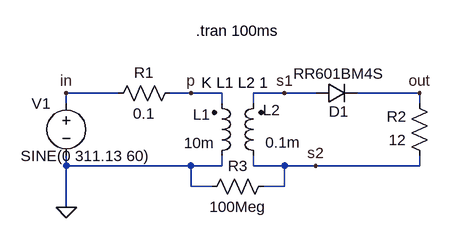
[diagram p0: schematic Exp01_ret.asc]
Exp01_ret.asc, the LTspice schematic file:
Version 4
SHEET 1 880 680
WIRE 352 112 272 112
WIRE 464 112 432 112
WIRE 512 112 464 112
WIRE 608 112 560 112
WIRE 656 112 608 112
WIRE 816 112 720 112
WIRE 272 128 272 112
WIRE 512 128 512 112
WIRE 560 128 560 112
WIRE 816 128 816 112
WIRE 272 224 272 208
WIRE 464 224 272 224
WIRE 512 224 512 208
WIRE 512 224 464 224
WIRE 560 224 560 208
WIRE 608 224 560 224
WIRE 656 224 608 224
WIRE 816 224 816 208
WIRE 816 224 656 224
WIRE 464 256 464 224
WIRE 496 256 464 256
WIRE 608 256 608 224
WIRE 608 256 576 256
WIRE 272 288 272 224
FLAG 272 288 0
FLAG 272 112 in
FLAG 464 112 p
FLAG 608 112 s1
FLAG 656 224 s2
FLAG 816 112 out
SYMBOL voltage 272 112 M0
WINDOW 3 -130 97 Left 2
WINDOW 123 0 0 Left 0
WINDOW 39 0 0 Left 0
SYMATTR InstName V1
SYMATTR Value SINE(0 311.13 60)
SYMBOL ind2 496 224 M180
WINDOW 0 -29 79 Left 2
WINDOW 3 -43 35 Left 2
SYMATTR InstName L1
SYMATTR Value 10m
SYMATTR Type ind
SYMBOL ind2 576 224 R180
WINDOW 0 -26 86 Left 2
WINDOW 3 -57 36 Left 2
SYMATTR InstName L2
SYMATTR Value 0.1m
SYMATTR Type ind
SYMBOL res 448 96 R90
WINDOW 0 0 56 VBottom 2
WINDOW 3 32 56 VTop 2
SYMATTR InstName R1
SYMATTR Value 0.1
SYMBOL res 832 224 R180
WINDOW 0 36 76 Left 2
WINDOW 3 36 40 Left 2
SYMATTR InstName R2
SYMATTR Value 12
SYMBOL res 480 272 R270
WINDOW 0 32 56 VTop 2
WINDOW 3 0 56 VBottom 2
SYMATTR InstName R3
SYMATTR Value 100Meg
SYMBOL diode 656 128 R270
WINDOW 0 -28 36 VTop 2
WINDOW 3 62 36 VBottom 2
SYMATTR InstName D1
SYMATTR Value RR601BM4S
TEXT 480 96 Left 2 !K L1 L2 1
TEXT 472 16 Left 2 !.tran 100ms

The netlist it stands for:
* Exp01_ret.asc
V1 in 0 SINE(0 311.13 60)
L1 0 p 10m
L2 s2 s1 0.1m
R1 p in 0.1
R2 s2 out 12
R3 0 s2 100Meg
D1 s1 out RR601BM4S
.model D D
.lib standard.dio
K L1 L2 1
.tran 100ms
.backanno
.end

* Results of the author's LTspice run, read from the files saved beside the schematic
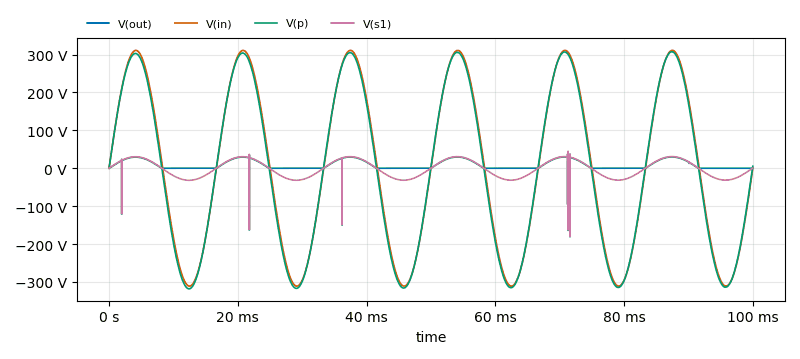
[diagram p1: Transient Analysis of Exp01_ret.asc, plotted from the saved traces]
* Transient Analysis, 1 run:
*   V(out): min -181.2 V, max 43.81 V, average 9.21 V, rms 14.65 V, last 9.563 mV
*   V(in): min -311.1 V, max 311.1 V, average 1.12 mV, rms 220 V, last 0 V
*   V(p): min -318.2 V, max 307.5 V, average -5.211 V, rms 219.7 V, last 5.217 V
*   V(s1): min -180.3 V, max 44.7 V, average -521.1 mV, rms 21.97 V, last 521.7 mV